# EAGLE design stepper_driver (EAGLE 6.2)
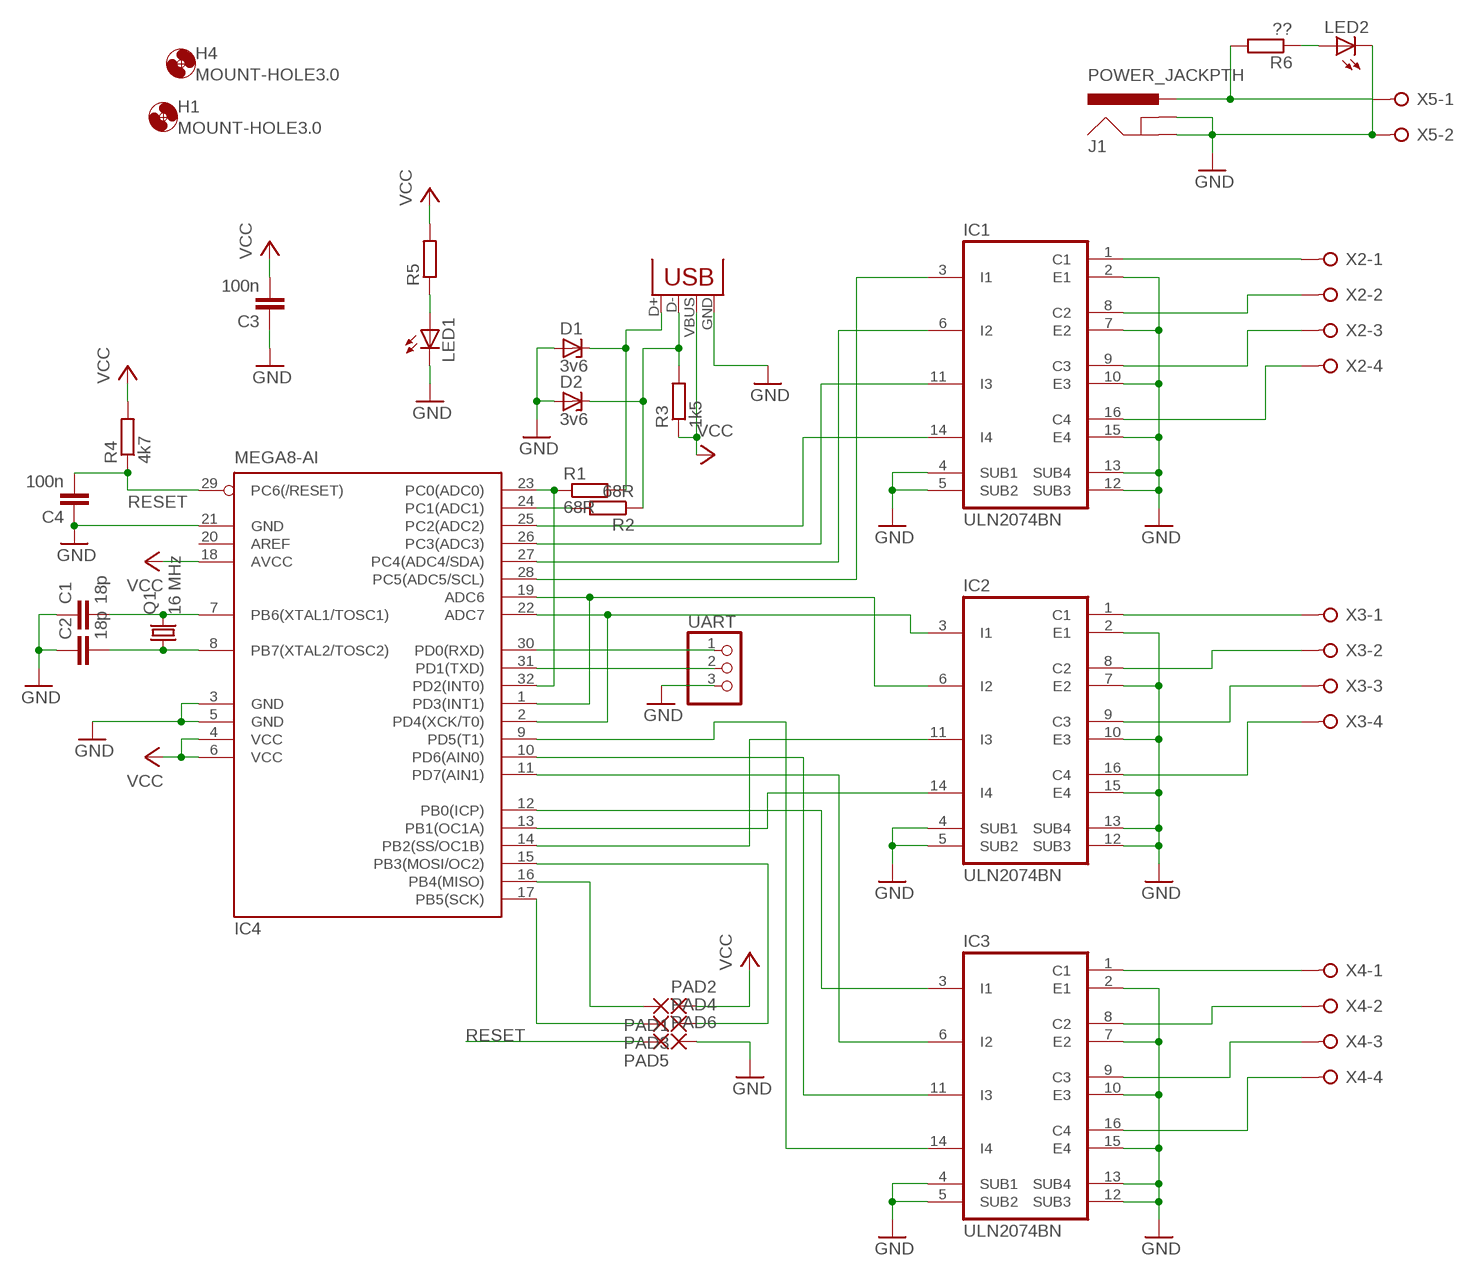
[diagram p0: schematic, sheet 1]

## Parts
C1  18p  C-EU025-025X050  [C025-025X050]
C2  18p  C-EU025-025X050  [C025-025X050]
C3  100n  C-EU025-025X050  [C025-025X050]
C4  100n  C-EU025-025X050  [C025-025X050]
D1  3v6  ZENER-DIODEDO35Z10  [DO35Z10]
D2  3v6  ZENER-DIODEDO35Z10  [DO35Z10]
H1  MOUNT-HOLE3.0  [3,0]
H4  MOUNT-HOLE3.0  [3,0]
IC1  ULN2074BN  [DIL16]
IC2  ULN2074BN  [DIL16]
IC3  ULN2074BN  [DIL16]
IC4  MEGA8-AI  [TQFP32-08]
J1  POWER_JACKPTH  [POWER_JACK_PTH]
LED1  LED3MM  [LED3MM]
LED2  LED3MM  [LED3MM]
PAD1  2,15/1,0  [2,15/1,0]
PAD2  2,15/1,0  [2,15/1,0]
PAD3  2,15/1,0  [2,15/1,0]
PAD4  2,15/1,0  [2,15/1,0]
PAD5  2,15/1,0  [2,15/1,0]
PAD6  2,15/1,0  [2,15/1,0]
Q1  16 MHz  CRYSTALHC49S  [HC49/S]
R1  68R  R-EU_0207/10  [0207/10]
R2  68R  R-EU_0207/10  [0207/10]
R3  1k5  R-EU_0207/10  [0207/10]
R4  4k7  R-EU_0207/10  [0207/10]
R5  R-EU_0207/10  [0207/10]
R6  ??  R-EU_0207/10  [0207/10]
UART  PINHD-1X3  [1X03]
X1  USBPTH  [USB-B-PTH]
X2  W237-04P  [W237-4P]
X3  W237-04P  [W237-4P]
X4  W237-04P  [W237-4P]
X5  W237-02P  [W237-132]

## Nets
GND: C1.1 C2.1 C3.1 C4.1 D1.A D2.A IC1.2(E1) IC1.4(SUB1) IC1.5(SUB2) IC1.7(E2) IC1.10(E3) IC1.12(SUB3) IC1.13(SUB4) IC1.15(E4) IC2.2(E1) IC2.4(SUB1) IC2.5(SUB2) IC2.7(E2) IC2.10(E3) IC2.12(SUB3) IC2.13(SUB4) IC2.15(E4) IC3.2(E1) IC3.4(SUB1) IC3.5(SUB2) IC3.7(E2) IC3.10(E3) IC3.12(SUB3) IC3.13(SUB4) IC3.15(E4) IC4.3(GND) IC4.5(GND) IC4.21(GND) J1.GND J1.GNDBREAK LED1.K(C) LED2.K(C) PAD6.1(P) UART.3 X1.GND X5.2
N$1: C2.2 IC4.8(PB7(XTAL2/TOSC2)) Q1.1
N$2: C1.2 IC4.7(PB6(XTAL1/TOSC1)) Q1.2
N$3: IC4.15(PB3(MOSI/OC2)) PAD4.1(P)
N$4: IC4.23(PC0(ADC0)) IC4.32(PD2(INT0)) R1.1
N$5: IC4.24(PC1(ADC1)) R2.2
N$6: D1.C R1.2 X1.D+
N$7: D2.C R2.1 R3.2 X1.D-
N$8: IC1.14(I4) IC4.25(PC2(ADC2))
N$9: IC1.11(I3) IC4.26(PC3(ADC3))
N$10: IC1.6(I2) IC4.27(PC4(ADC4/SDA))
N$11: IC1.3(I1) IC4.28(PC5(ADC5/SCL))
N$12: IC2.6(I2) IC4.1(PD3(INT1)) IC4.19(ADC6)
N$13: IC2.3(I1) IC4.2(PD4(XCK/T0)) IC4.22(ADC7)
N$14: IC4.17(PB5(SCK)) PAD3.1(P)
N$15: IC4.16(PB4(MISO)) PAD1.1(P)
N$16: IC2.11(I3) IC4.14(PB2(SS/OC1B))
N$17: IC2.14(I4) IC4.13(PB1(OC1A))
N$18: IC3.3(I1) IC4.12(PB0(ICP))
N$19: IC3.6(I2) IC4.11(PD7(AIN1))
N$20: IC3.14(I4) IC4.9(PD5(T1))
N$21: IC3.11(I3) IC4.10(PD6(AIN0))
N$22: IC4.30(PD0(RXD)) UART.1
N$23: IC4.31(PD1(TXD)) UART.2
N$24: IC1.1(C1) X2.1
N$25: IC1.8(C2) X2.2
N$26: IC1.9(C3) X2.3
N$27: IC1.16(C4) X2.4
N$28: IC2.1(C1) X3.1
N$29: IC2.8(C2) X3.2
N$30: IC2.9(C3) X3.3
N$31: IC2.16(C4) X3.4
N$32: IC3.1(C1) X4.1
N$33: IC3.8(C2) X4.2
N$34: IC3.9(C3) X4.3
N$35: IC3.16(C4) X4.4
N$36: LED1.A R5.1
N$37: J1.PWR R6.2 X5.1
N$38: LED2.A R6.1
RESET: C4.2 IC4.29(PC6(/RESET)) PAD5.1(P) R4.1
VCC: C3.2 IC4.4(VCC) IC4.6(VCC) IC4.18(AVCC) PAD2.1(P) R3.1 R4.2 R5.2 X1.VBUS
Unconnected: IC4.20(AREF)

## Library data of the parts
C1-C4 = resistor:C-EU: CAPACITOR, European symbol
D1 D2 = diode:ZENER-DIODE: Z-Diode
H1 H4 = holes:MOUNT-HOLE: MOUNTING HOLE with drill center marker
IC1-IC3 = uln-udn:ULN2074B: DRIVER ARRAY
IC4 = atmel:MEGA8: MICROCONTROLLER 8 Kbytes FLASH, 1 kbytes SRAM, 512 bytes EEPROM, USART, 6-channel 10 bit ADC, 2-channel 8 bit ADC Pin compatible with Atmega48, ATMega88, ATMega168 Source: avr.lbr; MPN: ATMEGA8-16AU; OC_FARNELL: 9171371; OC_NEWARK: 73M8863
J1 = SparkFun:POWER_JACK: Power Jack This is the standard 5.5mm barrel jack for power. The PTH is the most common, proven, reliable, footprint. All others are experimental. The Slot footprint only works if the mill layer is transmitted to the PCB fab house so be warned. Spark Fun Electronics SKU : PRT-00119. Mating wall wart : TOL-00298 (and others)
LED1 LED2 = led:LED: LED OSRAM: - CHIPLED LG R971, LG N971, LY N971, LG Q971, LY Q971, LO R971, LY R971 LH N974, LH R974 LS Q976, LO Q976, LY Q976 LO Q996 - Hyper CHIPLED LW Q18S LB Q993, LB Q99A, LB R99A - SideLED LS A670, LO A670, LY A670, LG A670, LP A670 LB A673, LV A673, LT A673, LW A673 LH A674 LY A675 LS A676, LA A676, LO A676, LY A676, LW A676 LS A679, LY A679, LG A679 - Hyper Micro SIDELED® LS Y876, LA Y876, LO Y876, LY Y876 LT Y87S - SmartLED LW L88C, LW L88S LB L89C, LB L89S, LG L890 LS L89K, LO L89K, LY L89K LS L896, LA L896, LO L896, LY L896 - TOPLED LS T670, LO T670, LY T670, LG T670, LP T670 LSG T670, LSP T670, LSY T670, LOP T670, LYG T670 LG T671, LOG T671, LSG T671 LB T673, LV T673, LT T673, LW T673 LH T674 LS T676, LA T676, LO T676, LY T676, LB T676, LH T676, LSB T676, LW T676 LB T67C, LV T67C, LT T67C, LS T67K, LO T67K, LY T67K, LW E67C LS E67B, LA E67B, LO E67B, LY E67B, LB E67C, LV E67C, LT E67C LW T67C LS T679, LY T679, LG T679 LS T770, LO T770, LY T770, LG T770, LP T770 LB T773, LV T773, LT T773, LW T773 LH T774 LS E675, LA E675, LY E675, LS T675 LS T776, LA T776, LO T776, LY T776, LB T776 LHGB T686 LT T68C, LB T68C - Hyper Mini TOPLED® LB M676 - Mini TOPLED Santana® LG M470 LS M47K, LO M47K, LY M47K Source: http://www.osram.convergy.de LUXEON: - LUMILED® LXK2-PW12-R00, LXK2-PW12-S00, LXK2-PW14-U00, LXK2-PW14-V00 LXK2-PM12-R00, LXK2-PM12-S00, LXK2-PM14-U00 LXK2-PE12-Q00, LXK2-PE12-R00, LXK2-PE12-S00, LXK2-PE14-T00, LXK2-PE14-U00 LXK2-PB12-K00, LXK2-PB12-L00, LXK2-PB12-M00, LXK2-PB14-N00, LXK2-PB14-P00, LXK2-PB14-Q00 LXK2-PR12-L00, LXK2-PR12-M00, LXK2-PR14-Q00, LXK2-PR14-R00 LXK2-PD12-Q00, LXK2-PD12-R00, LXK2-PD12-S00 LXK2-PH12-R00, LXK2-PH12-S00 LXK2-PL12-P00, LXK2-PL12-Q00, LXK2-PL12-R00 Source: www.luxeon.com KINGBRIGHT: KA-3528ASYC Source: www.kingbright.com
PAD1-PAD6 = wirepad:2,15/1,0: THROUGH-HOLE PAD
Q1 = crystal:CRYSTAL: CRYSTAL; OC_FARNELL: 1667008; OC_NEWARK: unknown
R1-R6 = resistor:R-EU_: RESISTOR, European symbol
UART = pinhead:PINHD-1X3: PIN HEADER
X1 = SparkFun:USB: USB Connectors USB-B-PTH is fully proven SKU : PRT-00139 USB-miniB is fully proven SKU : PRT-00587 USB-A-PCB is untested. USB-A-H is throughly reviewed, but untested. Spark Fun Electronics SKU : PRT-00437 USB-B-SMT is throughly reviewed, but untested. Needs silkscreen touching up. USB-A-S has not been used/tested USB-MB-H has not been used/tested
X2-X4 = con-wago-508:W237-04P: WAGO SREW CLAMP; OC_FARNELL: unknown; OC_NEWARK: unknown
X5 = con-wago-508:W237-02P: WAGO SREW CLAMP; OC_FARNELL: unknown; OC_NEWARK: unknown

## Board
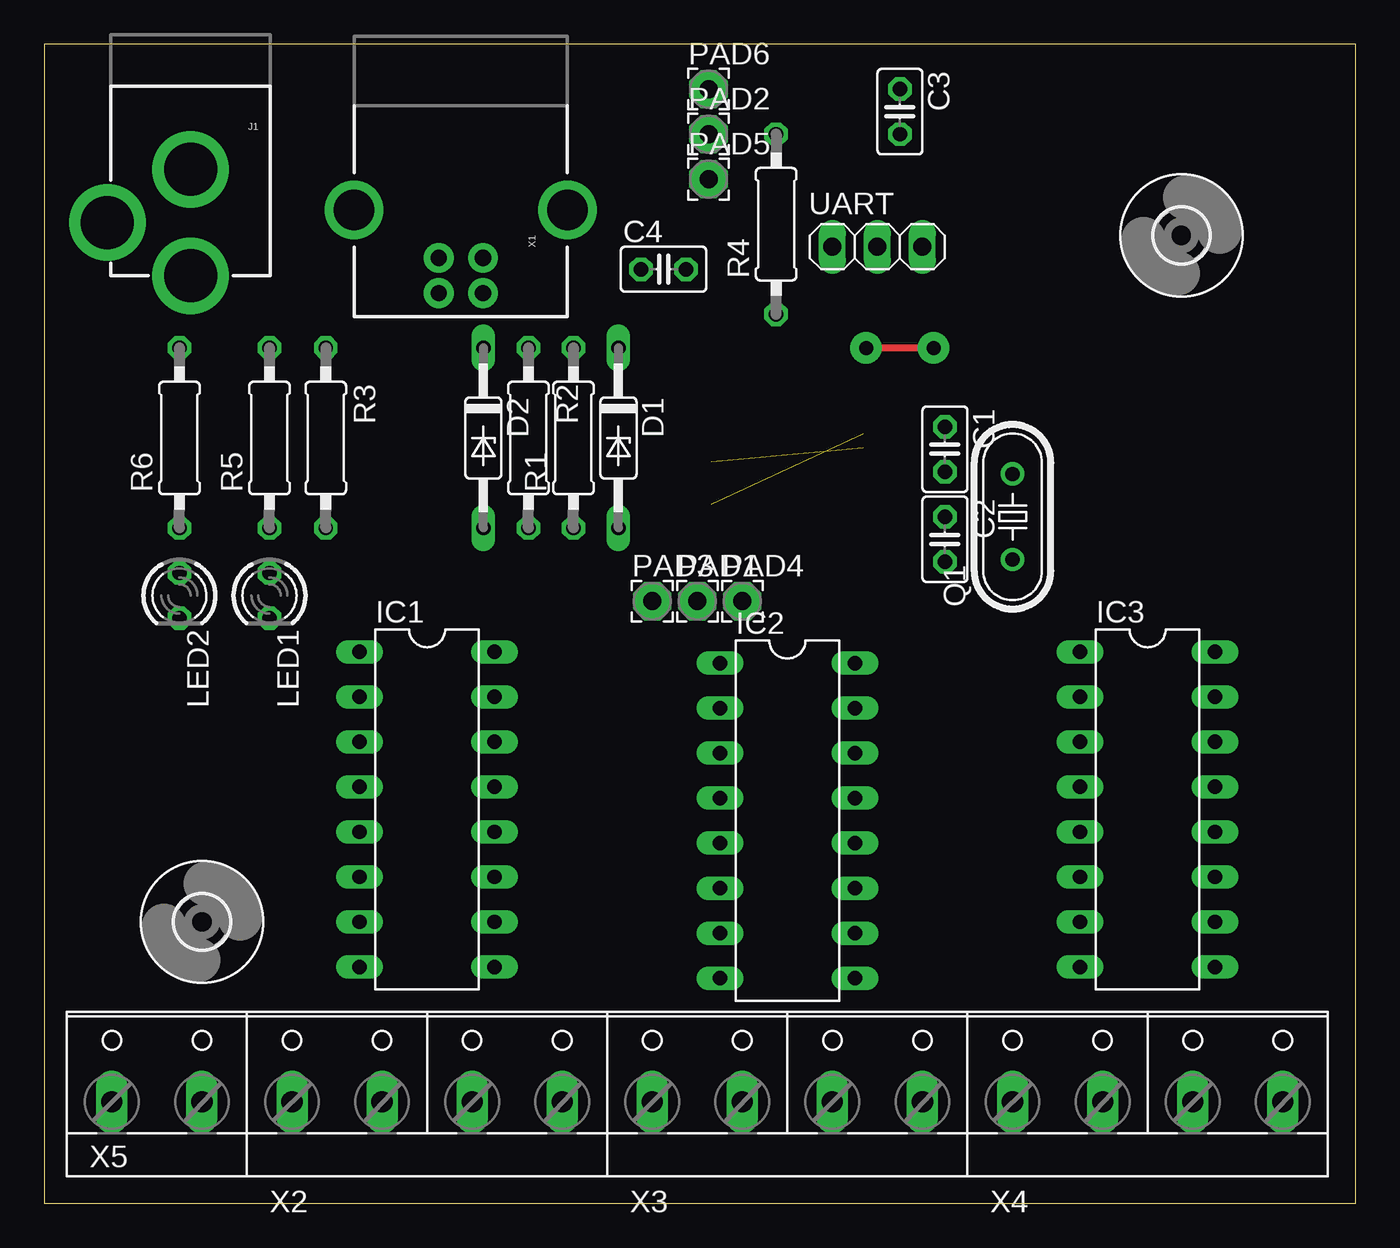
[diagram p1: board, top side]
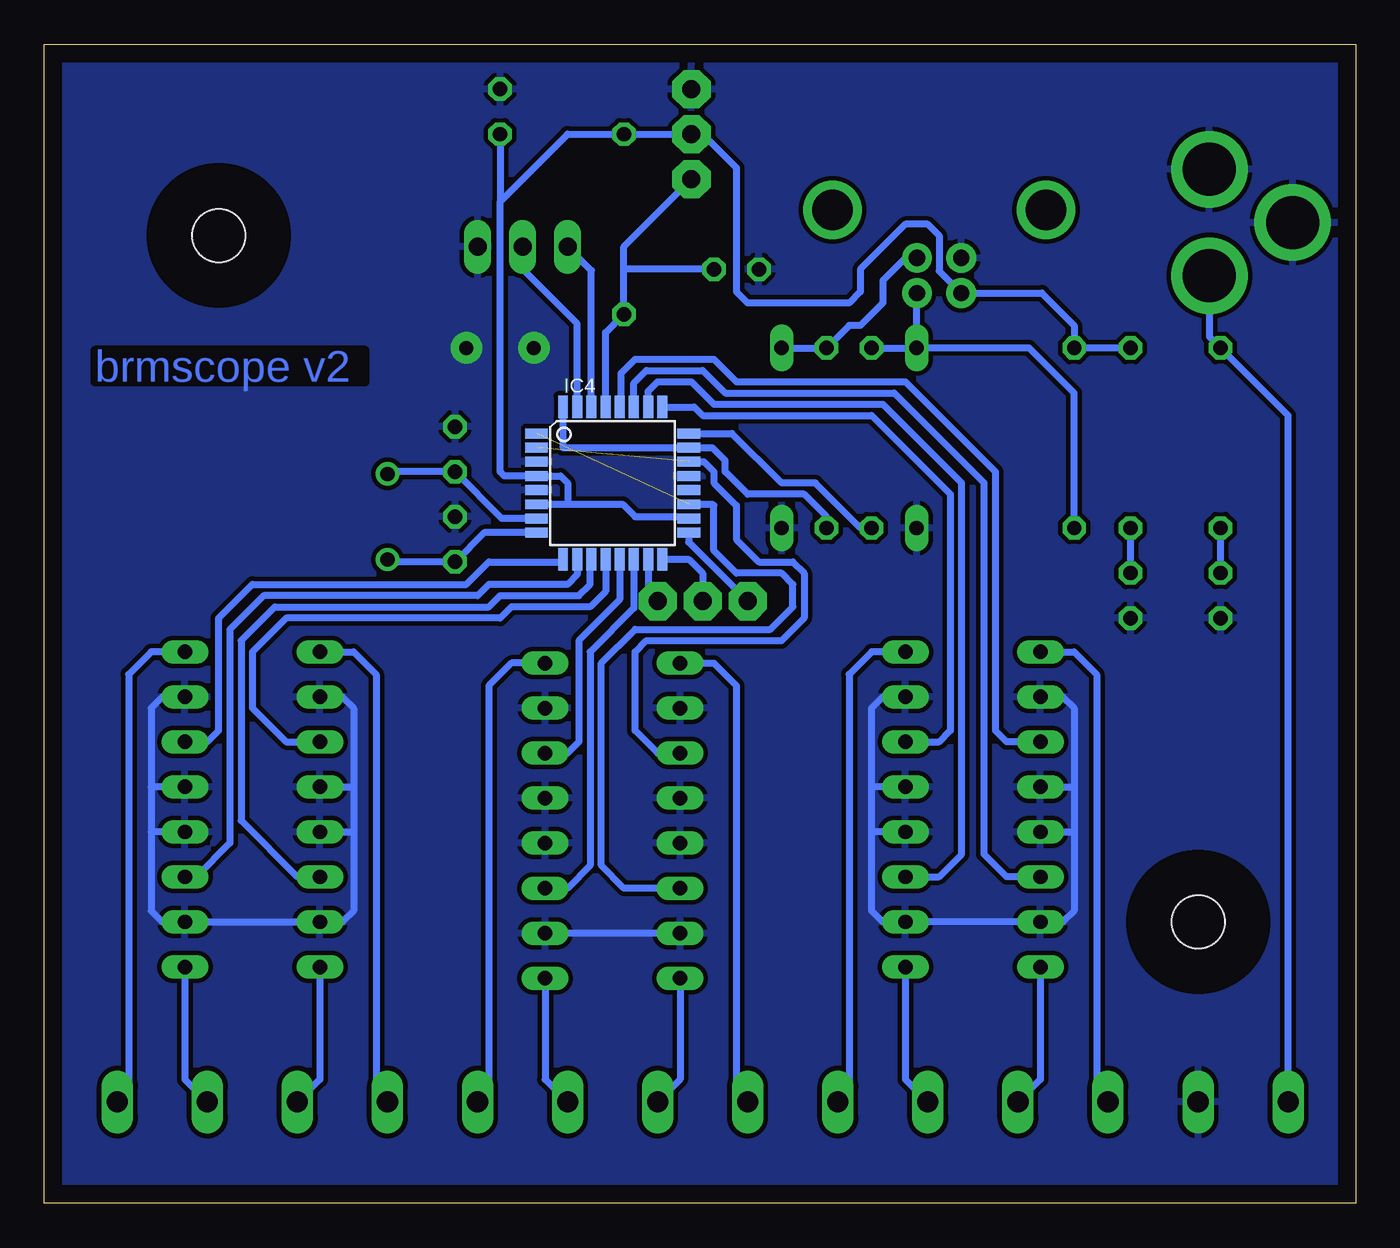
[diagram p2: board, bottom side, seen from below]

Size 73.97 x 65.39 mm. Coordinates in mm from the lower left corner, seen from the top.
Outline: 0,0 73.97,0 73.97,65.39 0,65.39 0,0
Copper layers (1*16): Top 0.035mm / dielectric 1.5mm / Bottom 0.035mm
Design rules: minimum track width 10mil, minimum drill 24mil, track to track 10mil, track to pad 10mil, pad to pad 10mil, via to via 10mil, smd to smd 8mil, copper to edge 40mil, drill to drill 8mil, minimum pad ring 10mil, minimum via ring 8mil, stop-mask expansion 4mil, vias tented up to drill 0mil, thermal gap 10mil

### Footprints (pad centres in the part's own frame; a part is rotated, then mirrored left to right if it is on the bottom)
C025-025X050 = drill 0.813 octagon: 1 -1.27,0; 2 1.27,0
DO35Z10 = drill 0.813 long: A 5.08,0; C -5.08,0
3,0 = hole 3: 0,0
DIL16 = drill 0.813 long: 1 -8.89,-3.81; 2 -6.35,-3.81; 3 -3.81,-3.81; 4 -1.27,-3.81; 5 1.27,-3.81; 6 3.81,-3.81; 7 6.35,-3.81; 8 8.89,-3.81; 9 8.89,3.81; 10 6.35,3.81; 11 3.81,3.81; 12 1.27,3.81; 13 -1.27,3.81; 14 -3.81,3.81; 15 -6.35,3.81; 16 -8.89,3.81
TQFP32-08 = smd 1.27 x 0.559: 1 -4.293,2.8; 2 -4.293,2; 3 -4.293,1.2; 4 -4.293,0.4; 5 -4.293,-0.4; 6 -4.293,-1.2; 7 -4.293,-2; 8 -4.293,-2.8; 17 4.293,-2.8; 18 4.293,-2; 19 4.293,-1.2; 20 4.293,-0.4; 21 4.293,0.4; 22 4.293,1.2; 23 4.293,2; 24 4.293,2.8 | smd 0.559 x 1.27: 9 -2.8,-4.293; 10 -2,-4.293; 11 -1.2,-4.293; 12 -0.4,-4.293; 13 0.4,-4.293; 14 1.2,-4.293; 15 2,-4.293; 16 2.8,-4.293; 25 2.8,4.293; 26 2,4.293; 27 1.2,4.293; 28 0.4,4.293; 29 -0.4,4.293; 30 -1.2,4.293; 31 -2,4.293; 32 -2.8,4.293
POWER_JACK_PTH = drill 2.997 pad 4.318: GND 0,7.7; GNDBREAK 4.7,10.7; PWR 0,13.7
LED3MM = drill 0.813 octagon: A -1.27,0; K 1.27,0
2,15/1,0 = drill 1.016 pad 2.159 octagon: 1 0,0
HC49/S = drill 0.813: 1 -2.413,0; 2 2.413,0
0207/10 = drill 0.813 octagon: 1 -5.08,0; 2 5.08,0
1X03 = drill 1.016 long: 1 -2.54,0; 2 0,0; 3 2.54,0
USB-B-PTH = drill 0.914 pad 1.676: D+ 0,1.25; D- 1.981,1.25; GND 0,-1.25; VBUS 1.981,-1.25 | drill 2.286: S1 -2.718,-6.02; S2 -2.718,6.02
W237-4P = drill 1.194 long: 1 -7.62,-0.635; 2 -2.54,-0.635; 3 2.54,-0.635; 4 7.62,-0.635
W237-132 = drill 1.194 long: 1 -2.54,-0.635; 2 2.54,-0.635

### Placement (x,y rotation side)
C1  50.8,42.55 270 top
C2  50.8,37.47 270 top
C3  48.26,61.59 270 top
C4  34.92,52.7 0 top
D1  32.38,43.18 270 top
D2  24.77,43.18 270 top
H1  8.89,15.88 0 top
H4  64.14,54.61 0 top
IC1  21.59,22.23 270 top
IC2  41.91,21.59 270 top
IC3  62.23,22.23 270 top
IC4  41.91,40.64 0 bottom
J1  8.26,66.04 180 top
LED1  12.7,34.29 270 top
LED2  7.62,34.29 270 top
PAD1  36.83,33.97 0 top
PAD2  37.47,60.33 0 top
PAD3  34.29,33.97 0 top
PAD4  39.37,33.97 0 top
PAD5  37.47,57.78 0 top
PAD6  37.47,62.87 0 top
Q1  54.61,38.73 90 top
R1  29.84,43.18 90 top
R2  27.3,43.18 270 top
R3  15.88,43.18 270 top
R4  41.27,55.24 90 top
R5  12.7,43.18 90 top
R6  7.62,43.18 90 top
UART  46.99,53.98 0 top
X1  23.5,53.34 270 top
X2  21.59,6.35 0 top
X3  41.91,6.35 0 top
X4  62.23,6.35 0 top
X5  6.35,6.35 0 top

### Tracks (layer width: path | path; a pad name or v marks a point on that pad's centre or on a via)
GND  (via drill 0.8 pad 1.78)
  Top 0.406: v50.16,48.26 v46.35,48.26
  Bottom 0.406: IC1.2 16.51,28.57 15.88,27.94 15.88,23.5 | 15.88,23.5 15.88,20.95 | 15.88,20.95 15.88,16.51 16.51,15.88 IC1.7 IC1.10 26.67,15.88 27.3,16.51 27.3,20.95 | IC1.4 15.88,23.5 | IC1.5 15.88,20.95 | 27.3,20.95 27.3,23.5 | 27.3,23.5 27.3,27.94 26.67,28.57 IC1.15 | IC1.13 27.3,23.5 | IC1.12 27.3,20.95 | IC3.2 57.15,28.57 56.52,27.94 56.52,23.5 | 56.52,23.5 56.52,20.95 | 56.52,20.95 56.52,16.51 57.15,15.88 IC3.7 IC3.10 67.31,15.88 67.94,16.51 67.94,20.95 | IC3.4 56.52,23.5 | IC3.5 56.52,20.95 | 67.94,23.5 67.94,27.94 67.31,28.57 IC3.15 | IC3.12 67.94,20.95 | IC3.13 67.94,23.5 | 67.94,23.5 67.94,20.95 | IC2.7 IC2.10
  pour Bottom: -1.91,-1.91 78.74,-1.91 78.74,73.03 -1.91,73.03
N$1
  Bottom 0.406: IC4.8 49.16,37.84 C2.2 54.48,36.2 Q1.1
N$2
  Bottom 0.406: IC4.7 48.16,38.64 C1.2 54.48,41.27 Q1.2
N$3
  Bottom 0.406: IC4.15 39.91,34.51 PAD4.1
N$4
  Bottom 0.406: R1.1 29.84,38.73 31.11,40.01 34.29,40.01 35.56,41.27 35.56,41.91 36.29,42.64 IC4.23 44.71,42.64 IC4.32
N$5
  Bottom 0.406: R2.2 27.94,38.1 30.48,40.64 32.38,40.64 35.19,43.44 IC4.24
N$6
  Bottom 0.406: D1.C R1.2 28.57,49.53 27.94,49.53 26.67,50.8 26.67,52.07 25.4,53.34 X1.D+
N$7
  Bottom 0.406: R2.1 D2.C | D2.C 24.77,51.34 X1.D- | R3.2 15.88,45.72 18.41,48.26 D2.C
N$8
  Bottom 0.406: IC4.25 37.31,44.93 36.83,44.45 27.3,44.45 22.86,40.01 22.86,26.67 23.5,26.04 IC1.14
N$9
  Bottom 0.406: IC4.26 39.91,45.81 39.37,46.35 37.47,46.35 36.2,45.09 26.67,45.09 22.23,40.64 22.23,19.68 23.5,18.41 IC1.11
N$10
  Bottom 0.406: IC4.27 40.71,46.28 40.01,46.99 36.83,46.99 35.56,45.72 26.04,45.72 20.95,40.64 20.95,19.68 19.68,18.41 IC1.6
N$11
  Bottom 0.406: IC4.28 41.43,44.93 41.43,46.84 40.64,47.62 36.2,47.62 34.92,46.35 25.4,46.35 20.32,41.27 20.32,26.67 19.68,26.04 IC1.3
N$12  (1 unrouted)
  Bottom 0.406: IC2.6 41.27,17.78 42.55,19.05 42.55,30.48 40.64,32.38 33.02,32.38 31.75,33.66 31.75,34.92 32.38,35.56 34.92,35.56 36.2,36.83 36.2,39.37 36.27,39.44 IC4.19
N$13  (1 unrouted)
  Bottom 0.406: IC2.3 39.37,25.4 40.64,26.67 40.64,31.11 40.01,31.75 32.38,31.75 31.11,33.02 31.11,35.56 31.75,36.2 33.66,36.2 34.92,37.47 34.92,39.37 36.2,40.64 36.2,41.27 36.76,41.84 IC4.22 37.55,41.91
N$14
  Bottom 0.406: IC4.17 37.62,37.3 PAD3.1
N$15
  Bottom 0.406: IC4.16 37.62,36.35 36.83,35.56 PAD1.1
N$16
  Bottom 0.406: IC4.14 40.71,33.59 43.18,31.11 43.18,19.05 44.45,17.78 IC2.11
N$17
  Bottom 0.406: IC4.13 41.51,34.05 43.81,31.75 43.81,26.04 44.45,25.4 IC2.14
N$18
  Bottom 0.406: IC3.3 60.33,26.04 62.23,27.94 62.23,31.11 60.33,33.02 48.26,33.02 47.62,33.66 43.18,33.66 42.31,34.52 IC4.12
N$19
  Bottom 0.406: IC3.6 59.69,18.41 62.87,21.59 62.87,31.75 60.96,33.66 48.9,33.66 48.26,34.29 43.81,34.29 43.18,34.92 43.18,36.28 IC4.11
N$20
  Bottom 0.406: IC3.14 64.77,26.04 64.14,26.67 64.14,33.02 62.23,34.92 50.16,34.92 48.9,36.2 44.86,36.2 IC4.9
N$21
  Bottom 0.406: IC4.10 43.91,35.47 44.45,34.92 48.9,34.92 49.53,34.29 61.59,34.29 63.5,32.38 63.5,20.32 65.41,18.41 IC3.11
N$22
  Bottom 0.406: IC4.30 43.11,52.63 UART.1
N$23
  Bottom 0.406: IC4.31 43.91,49.62 46.99,52.7 UART.2
N$24
  Bottom 0.406: IC1.1 15.88,31.11 14.61,29.84 14.61,6.35 X2.1
N$25
  Bottom 0.406: IC1.8 17.78,6.99 X2.2
N$26
  Bottom 0.406: IC1.9 25.4,6.99 X2.3
N$27
  Bottom 0.406: IC1.16 27.3,31.11 28.57,29.84 28.57,6.35 X2.4
N$28
  Bottom 0.406: IC2.1 36.2,30.48 34.92,29.21 34.92,6.35 X3.1
N$29
  Bottom 0.406: IC2.8 38.1,6.99 X3.2
N$30
  Bottom 0.406: IC2.9 45.72,6.99 X3.3
N$31
  Bottom 0.406: IC2.16 47.62,30.48 48.9,29.21 48.9,6.35 X3.4
N$32
  Bottom 0.406: IC3.1 56.52,31.11 55.24,29.84 55.24,6.35 X4.1
N$33
  Bottom 0.406: IC3.8 58.42,6.99 X4.2
N$34
  Bottom 0.406: IC3.9 66.04,6.99 X4.3
N$35
  Bottom 0.406: IC3.16 67.94,31.11 69.22,29.84 69.22,6.35 X4.4
N$36
  Bottom 0.406: LED1.A R5.1
N$37
  Bottom 0.406: J1.PWR 8.26,48.9 R6.2 3.81,44.45 X5.1
N$38
  Bottom 0.406: LED2.A R6.1
RESET
  Bottom 0.406: IC4.29 42.31,49.13 R4.1 41.27,52.7 | 41.27,52.7 41.27,53.98 PAD5.1 | C4.2 41.27,52.7
VCC
  Bottom 0.406: IC4.6 44.45,39.44 | 44.45,39.44 41.34,39.44 40.64,38.73 37.71,38.73 IC4.18 | 44.45,39.44 44.45,40.64 44.85,41.04 IC4.4 48.02,41.04 48.26,41.27 48.26,56.52 | R5.2 R3.1 15.88,49.53 17.7,51.36 X1.VBUS 23.5,52.61 23.5,54.61 24.13,55.24 25.4,55.24 27.94,52.7 27.94,51.44 28.57,50.8 34.29,50.8 34.92,51.44 34.92,58.42 36.83,60.33 PAD2.1 R4.2 44.45,60.33 48.26,56.52 | C3.2 48.26,56.52

### Text on the board
Bottom: brmscope v2